# EAGLE design base (EAGLE 6.1)
APVD: B.F (15-01-03); DOC_ID: CLK-SCH-07; DOC_PART_NO: CLK-PC-07; DOC_REV: C; DOC_TITLE: Display (model B) - Base; PROJECT_NAME: Alarm Clock (Model B)

## Sheet 1 of 2
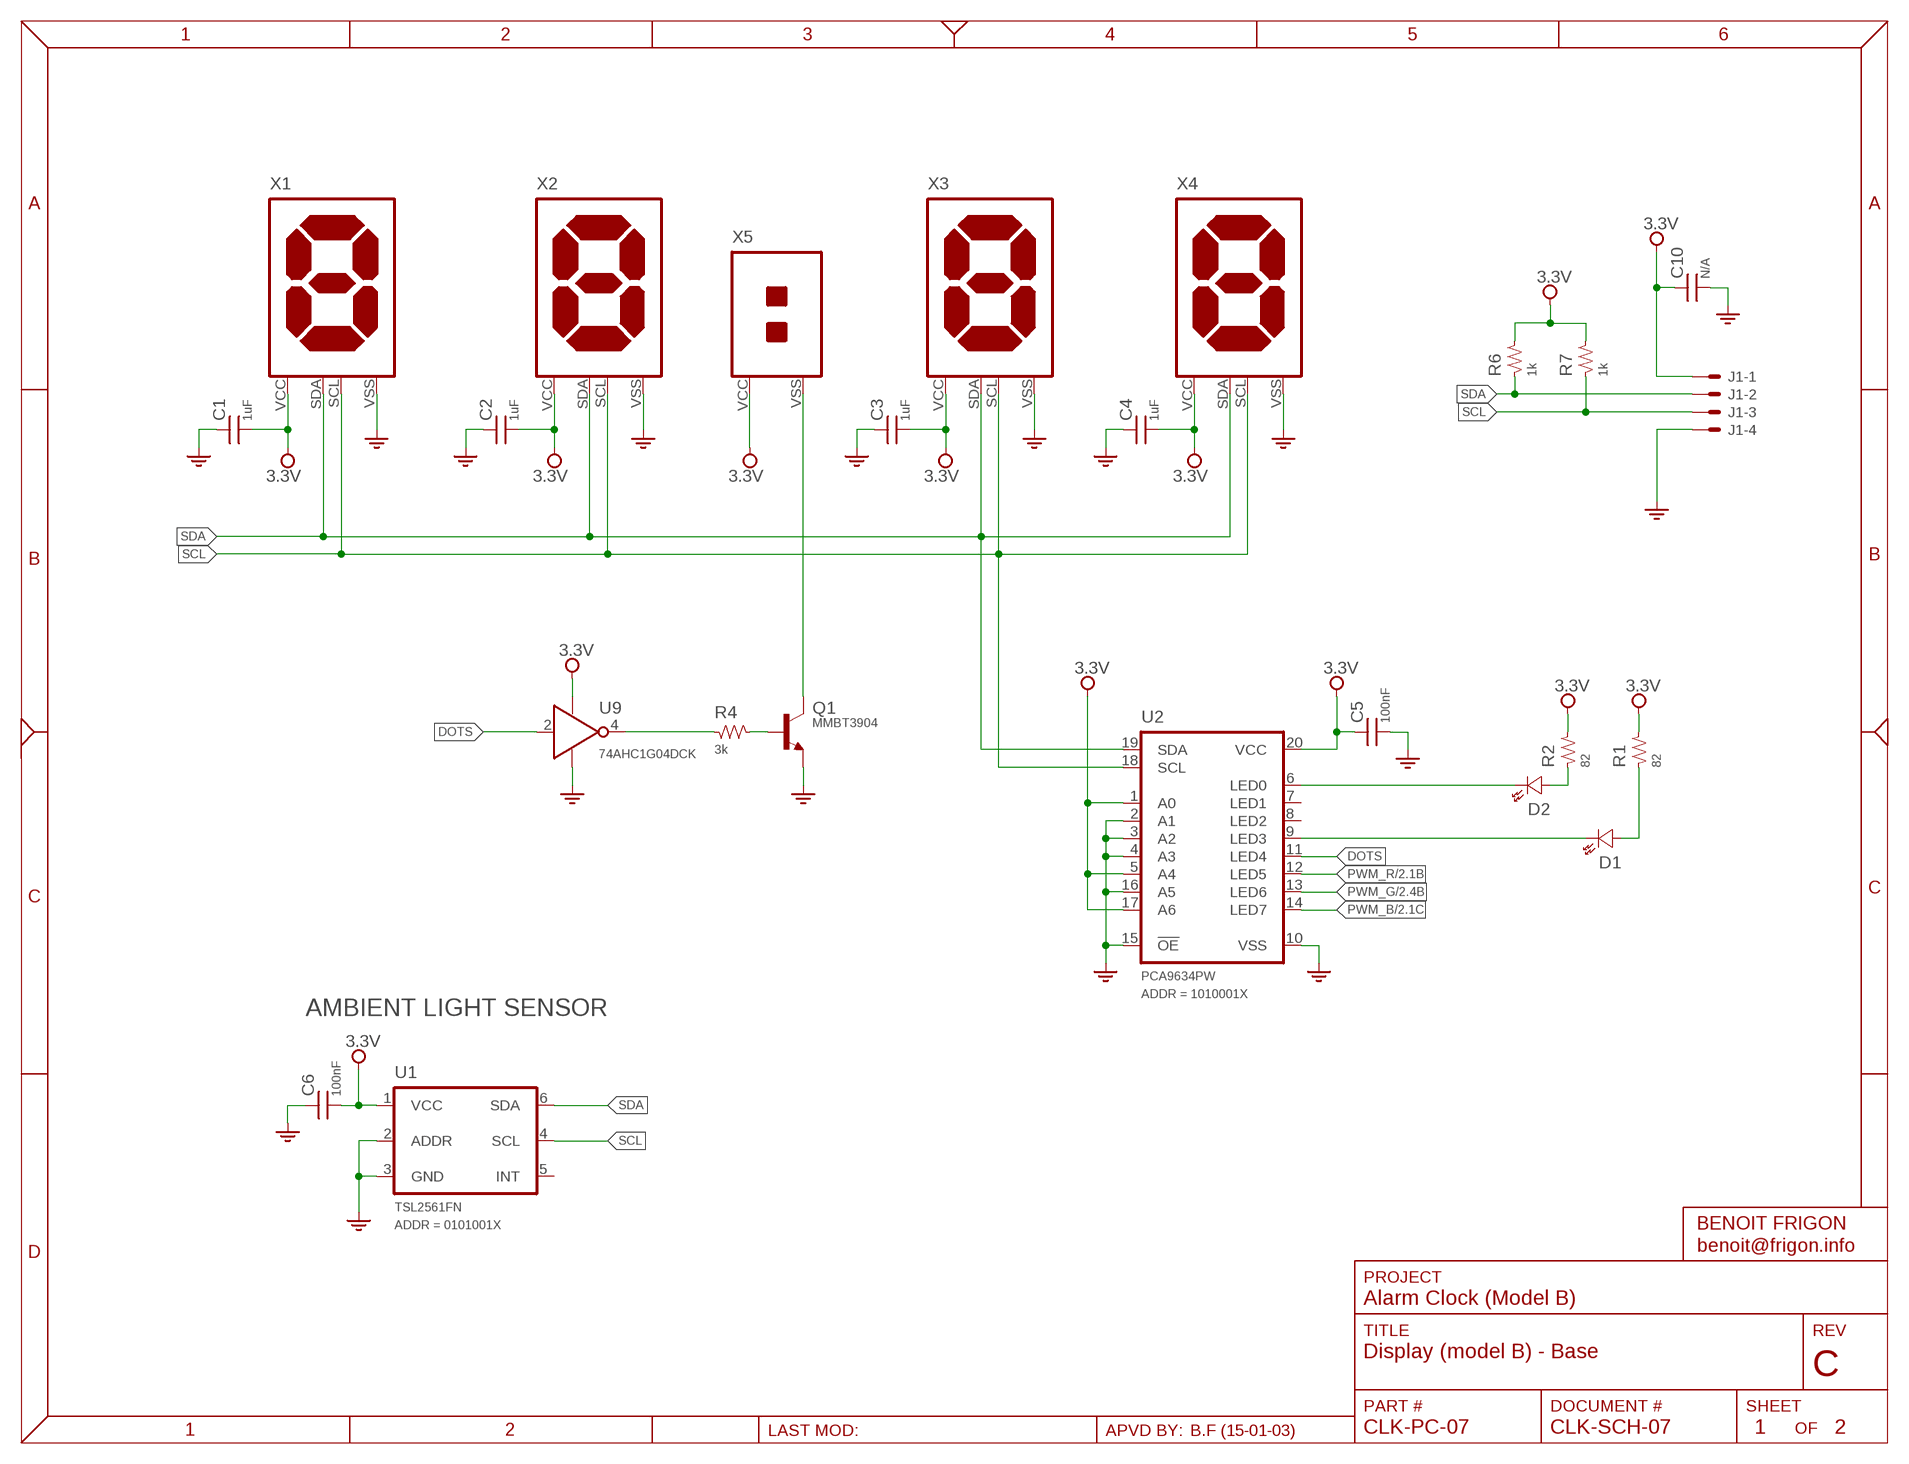
[diagram p0: schematic, sheet 1]

### Parts
C1  1uF  CAP-0603  [SMD_0603]
C2  1uF  CAP-0603  [SMD_0603]
C3  1uF  CAP-0603  [SMD_0603]
C4  1uF  CAP-0603  [SMD_0603]
C5  100nF  CAP-0603  [SMD_0603]
C6  100nF  CAP-0603  [SMD_0603]
C10  N/A  CAP-0805  [SMD_0805]
D1  {ATTR:COLOR}  LED-T1  [LED_3MM]
D2  {ATTR:COLOR}  LED-T1  [LED_3MM]
J1  SNG-2MM-HEADER-07-V  [DF3X-7P-2DSA]
Q1  MMBT3904  [SOT23]
R1  82  RES-0603  [SMD_0603]
R2  82  RES-0603  [SMD_0603]
R4  3k  RES-0603  [SMD_0603]
R6  1k  RES-0603  [SMD_0603]
R7  1k  RES-0603  [SMD_0603]
U1  TSL2561FN  [DFN-6]
U2  PCA9634PW  [TSSOP20]
U9  74AHC1G04DCK  [SC70-5]
X1  CLOCK_LED_SEGMENT  [CLOCK_LED_SEGMENT]
X2  CLOCK_LED_SEGMENT  [CLOCK_LED_SEGMENT]
X3  CLOCK_LED_SEGMENT  [CLOCK_LED_SEGMENT]
X4  CLOCK_LED_SEGMENT  [CLOCK_LED_SEGMENT]
X5  CLOCK_LED_DOTS  [CLOCK_LED_DOTS]

### Nets
3.3V: C1.2 C2.2 C3.2 C4.2 C5.1 C6.2 C10.1 J1.1 R1.2 R2.2 R6.2 R7.2 U1.1(VCC) U2.1(A0) U2.5(A4) U2.17(A6) U2.20(VCC) U9.5(VCC) X1.VCC X2.VCC X3.VCC X4.VCC X5.VCC ; also sheet 2
DOTS: U2.11(LED4) U9.2(A)
GND: C1.1 C2.1 C3.1 C4.1 C5.2 C6.1 C10.2 J1.4 Q1.2(E) U1.2(ADDR) U1.3(GND) U2.2(A1) U2.3(A2) U2.4(A3) U2.10(VSS) U2.15(!OE) U2.16(A5) U9.3(GND) X1.VSS X2.VSS X3.VSS X4.VSS ; also sheet 2
N$15: Q1.3(C) X5.VSS
N$16: Q1.1(B) R4.2
N$18: D2.K U2.6(LED0)
N$19: D2.A R2.1
N$20: D1.A R1.1
N$21: D1.K U2.9(LED3)
N$26: R4.1 U9.4(Y)
PWM_B: U2.14(LED7) ; also sheet 2
PWM_G: U2.13(LED6) ; also sheet 2
PWM_R: U2.12(LED5) ; also sheet 2
SCL: J1.3 R7.1 U1.4(SCL) U2.18(SCL) X1.SCL X2.SCL X3.SCL X4.SCL
SDA: J1.2 R6.1 U1.6(SDA) U2.19(SDA) X1.SDA X2.SDA X3.SDA X4.SDA
Unconnected: J1.5 J1.6 J1.7 U1.5(INT) U2.7(LED1) U2.8(LED2)

### Notes on the sheet
- AMBIENT LIGHT SENSOR

## Sheet 2 of 2: RGB Lighting
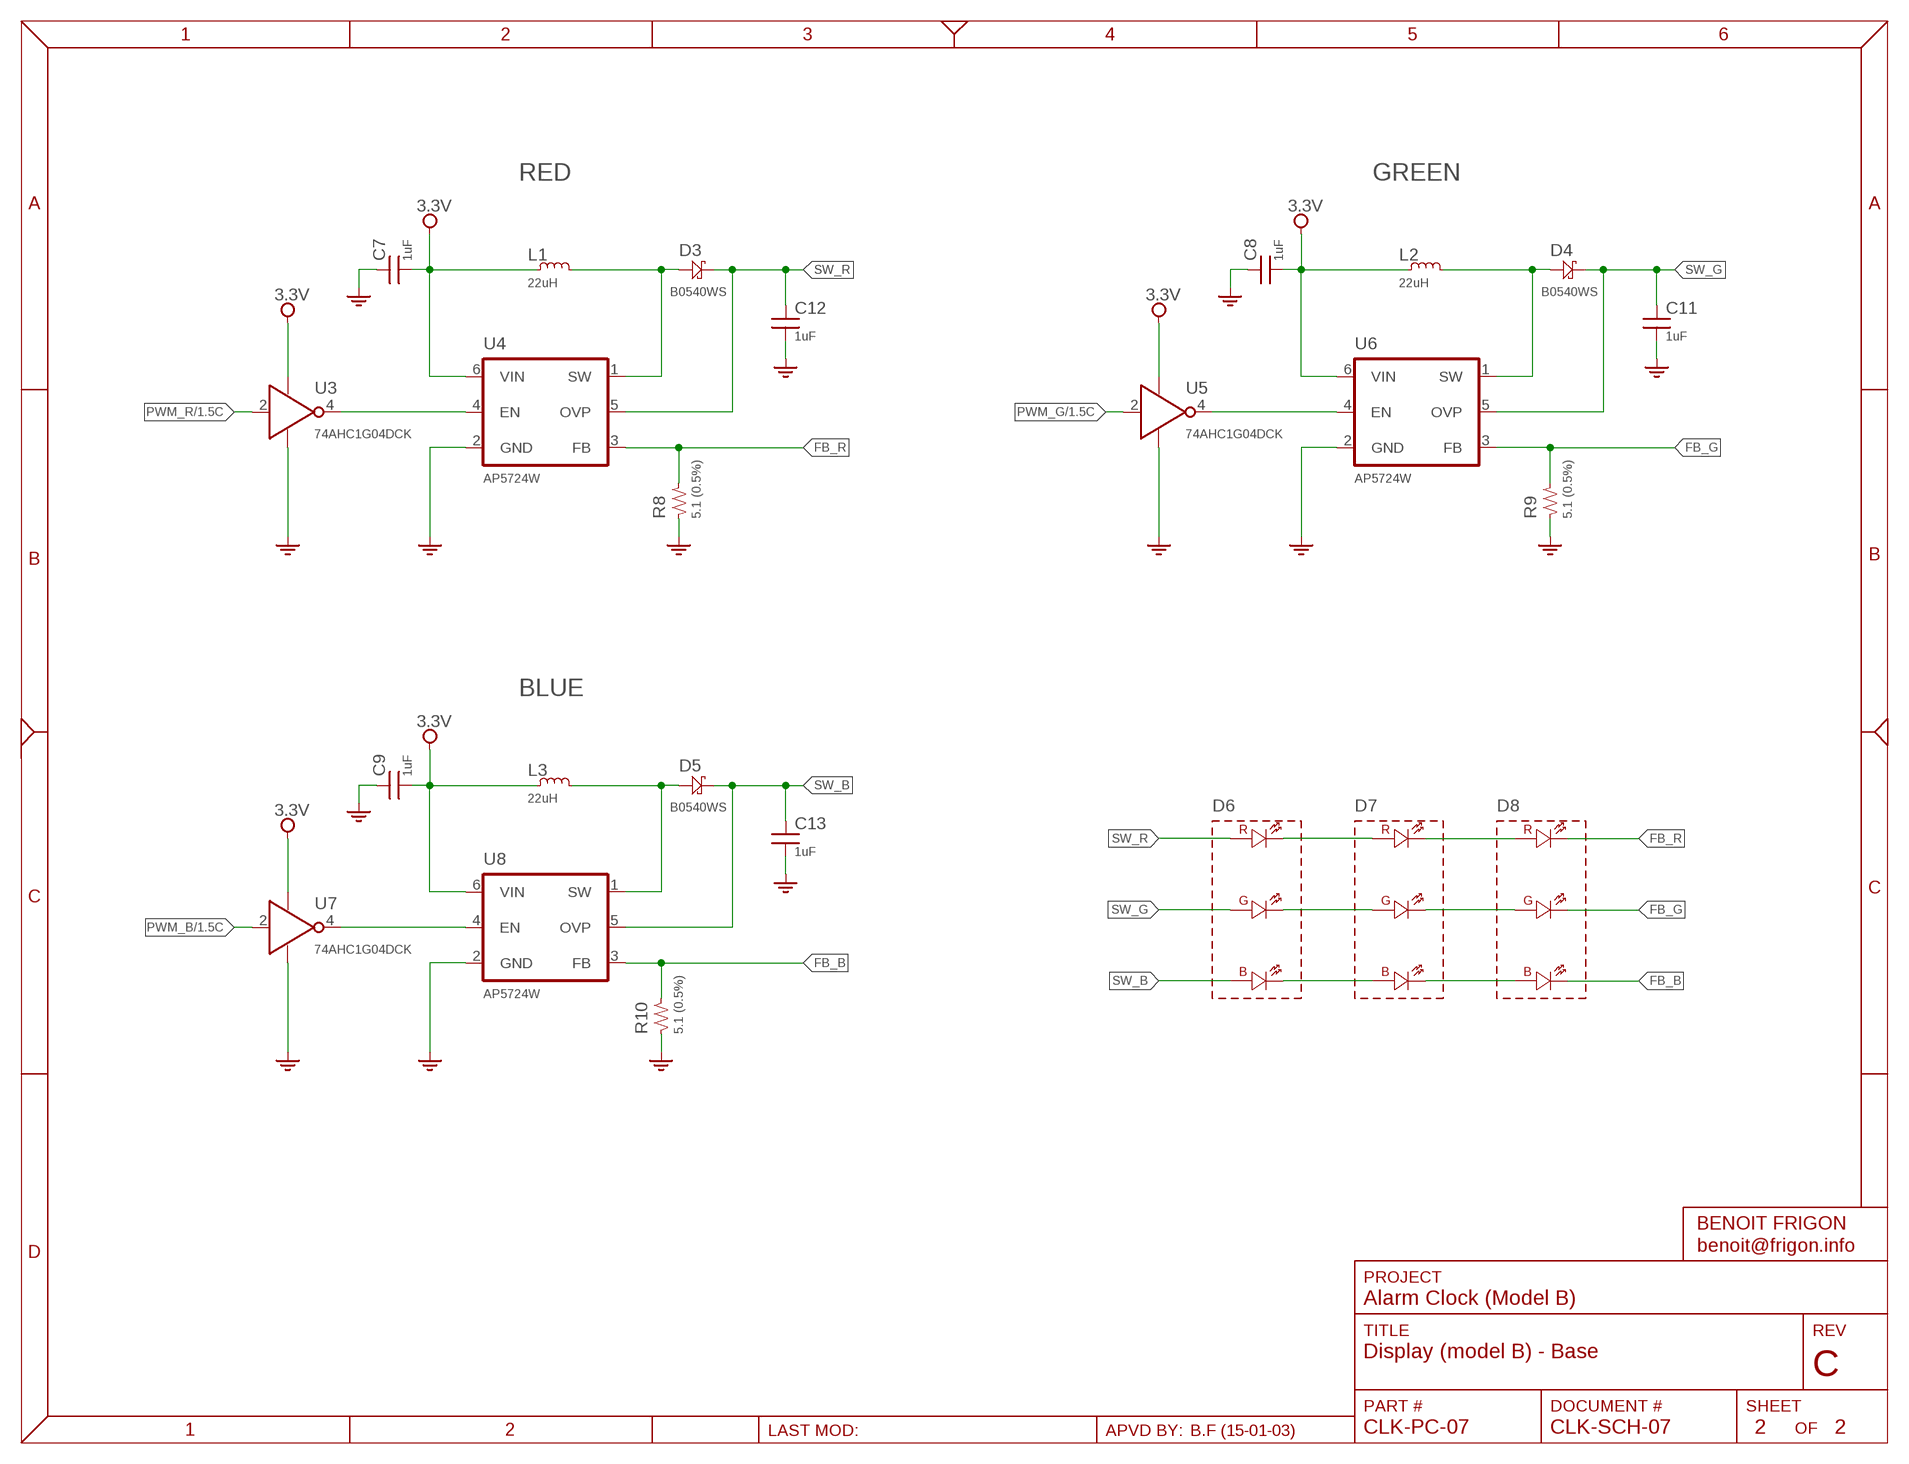
[diagram p1: schematic, sheet 2]
FRAME2 (FRAME_LETTER): DOC_SUBTITLE: RGB lighting

### Parts
C7  1uF  CAP-0603  [SMD_0603]
C8  1uF  CAP-0603  [SMD_0603]
C9  1uF  CAP-0603  [SMD_0603]
C11  1uF  CAP-0603  [SMD_0603]
C12  1uF  CAP-0603  [SMD_0603]
C13  1uF  CAP-0603  [SMD_0603]
D3  DIODE_SCHOTTKY-SOD323  [SOD-323]
D4  DIODE_SCHOTTKY-SOD323  [SOD-323]
D5  DIODE_SCHOTTKY-SOD323  [SOD-323]
D6  SMP6-RGB  [LED_RGB_PLCC6]
D7  SMP6-RGB  [LED_RGB_PLCC6]
D8  SMP6-RGB  [LED_RGB_PLCC6]
L1  22uH  IND-4X4  [IND-4X4]
L2  22uH  IND-4X4  [IND-4X4]
L3  22uH  IND-4X4  [IND-4X4]
R8  5.1 (0.5%)  RES-0603  [SMD_0603]
R9  5.1 (0.5%)  RES-0603  [SMD_0603]
R10  5.1 (0.5%)  RES-0603  [SMD_0603]
U3  74AHC1G04DCK  [SC70-5]
U4  AP5724W  [SOT23-6]
U5  74AHC1G04DCK  [SC70-5]
U6  AP5724W  [SOT23-6]
U7  74AHC1G04DCK  [SC70-5]
U8  AP5724W  [SOT23-6]

### Nets
3.3V: C7.2 C8.2 C9.2 L1.1 L2.1 L3.1 U3.5(VCC) U4.6(VIN) U5.5(VCC) U6.6(VIN) U7.5(VCC) U8.6(VIN) ; also sheet 1
FB_B: D8.5(BK) R10.2 U8.3(FB)
FB_G: D8.1(GK) R9.2 U6.3(FB)
FB_R: D8.3(RK) R8.2 U4.3(FB)
GND: C7.1 C8.1 C9.1 C11.2 C12.2 C13.2 R8.1 R9.1 R10.1 U3.3(GND) U4.2(GND) U5.3(GND) U6.2(GND) U7.3(GND) U8.2(GND) ; also sheet 1
N$1: D6.3(RK) D7.4(RA)
N$2: D7.3(RK) D8.4(RA)
N$3: D7.1(GK) D8.2(GA)
N$4: D6.1(GK) D7.2(GA)
N$5: D6.5(BK) D7.6(BA)
N$6: D7.5(BK) D8.6(BA)
N$8: D3.A L1.2 U4.1(SW)
N$10: D4.A L2.2 U6.1(SW)
N$12: D5.A L3.2 U8.1(SW)
N$25: U3.4(Y) U4.4(EN)
N$28: U5.4(Y) U6.4(EN)
N$29: U7.4(Y) U8.4(EN)
PWM_B: U7.2(A) ; also sheet 1
PWM_G: U5.2(A) ; also sheet 1
PWM_R: U3.2(A) ; also sheet 1
SW_B: C13.1 D5.K D6.6(BA) U8.5(OVP)
SW_G: C11.1 D4.K D6.2(GA) U6.5(OVP)
SW_R: C12.1 D3.K D6.4(RA) U4.5(OVP)

### Notes on the sheet
- RED | GREEN
- BLUE

## Library data of the parts
C1-C9 C11-C13 = Passive:CAP: Capacitor; DESCRIPTION: {DESCRIPTION} - SMT 0603 - {value}; PACKAGE: SMT 0603
C10 = Passive:CAP: Capacitor; DESCRIPTION: {DESCRIPTION} - SMT 0805 - {value}; PACKAGE: SMT 0805
D1 D2 = Optoelectronic:LED: Led; COLOR: Green; DESCRIPTION: {DESCRIPTION} T1 (3mm) - {ATTR:COLOR}; PACKAGE: T1; SKU: -
D3-D5 = Passive:DIODE_SCHOTTKY: Schottky Diode; DESCRIPTION: {DESCRIPTION} - SMT 0603 - {VALUE}; PACKAGE: SOD-323; PART_NO: B0540WS; SKU: {VALUE}
D6-D8 = Optoelectronic:SMP6-RGB: SMT RGB Led - PLCC6; MFG: Bivar; SKU: SMP6-RGB
J1 = Connectors:SNG-2MM-HEADER-07: 2mm Single Row Header - 7 pos; DESCRIPTION: {DESCRIPTION} - SMT Vertical; MFG: Hirose Electronic; PART_NO: DF3A-7P-2DSA; PRICE: 0.37; SKU: H2099-ND; SUPPLIER: Digi-Key
L1-L3 = Passive:IND?*: Inductor; PART_NO: NR4012T220M
Q1 = Transistor:MMBT3904: NPN Transistor
R1 R2 R4 R6-R10 = Passive:RES: Resistor; DESCRIPTION: {DESCRIPTION} - SMT 0603 - {VALUE}; PACKAGE: SMT 0603
U1 = Optoelectronic:TSL2561: Light-to-digital converter; ADDR: 0101001X
U2 = IC:PCA9634: 8-bit fm+ i2c-bus LED driver The PCA9634 is an I2C-bus controlled 8-bit LED driver optimized for Red/Green/Blue/Amber (RGBA) color mixing applications. Each LED output has its own 8-bit resolution (256 steps) fixed frequency Individual PWM controller that operates at 97 kHz with a duty cycle that is adjustable from 0 % to 99.6 % to allow the LED to be set to a specific brightness value. An additional 8-bit resolution (256 steps) Group PWM controller has both a fixed frequency of 190 Hz and an adjustable frequency between 24 Hz to once every 10.73 seconds with a duty cycle that is adjustable from 0 % to 99.6 % that is used to either dim or blink all LEDs with the same value. Features 8 LED drivers. Each output programmable at: Off On Programmable LED brightness Programmable group dimming/blinking mixed with individual LED brightness 1 MHz Fast-mode Plus compatible I2C-bus interface with 30 mA high drive capability on SDA output for driving high capacitive buses 256-step (8-bit) linear programmable brightness per LED output varying from fully off (default) to maximum brightness using a 97 kHz PWM signal 256-step group brightness control allows general dimming (using a 190 Hz PWM signal) from fully off to maximum brightness (default) 256-step group blinking with frequency programmable from 24 Hz to 10.73 s and duty cycle from 0 % to 99.6 % Eight totem-pole outputs (sink 25 mA and source 10 mA at 5 V) with software programmable open-drain LED outputs selection (default at totem-pole). No input function. Output state change programmable on the Acknowledge or the STOP Command to update outputs byte-by-byte or all at the same time (default to ‘Change on STOP’). Active LOW Output Enable (OE) input pin. LED outputs programmable to 1, 0 or ‘high-impedance’ (default at power-up) when OE is HIGH, thus allowing hardware blinking and dimming of the LEDs. 7 hardware address pins allow 126 devices to be connected to the same I2C-bus 4 software programmable I2C-bus addresses (one LED Group Call address and three LED Sub Call addresses) allow groups of devices to be addressed at the same time in any combination (for example, one register used for ‘All Call’ so that all the PCA9634s on the I2C-bus can be addressed at the same time and the second register used for three different addresses so that 1⁄3 of all devices on the bus can be addressed at the same time in a group). Software enable and disable for I2C-bus address. Software Reset feature (SWRST Call) allows the device to be reset through the I2C-bus 25 MHz internal oscillator requires no external components Internal power-on reset Noise filter on SDA/SCL inputs Edge rate control on outputs No glitch on power-up Supports hot insertion Low standby current Operating power supply voltage range of 2.3 V to 5.5 V 5.5 V tolerant inputs; ADDR: 1010001X; MFG: NXP Semiconductors
U3 U5 U7 U9 = Logic:74*1G04: NOT Gate - Single
U4 U6 U8 = IC:AP5724: White LED Step-up converter; MFG: Diodes Inc.
X1-X4 = Misc:CLOCK_LED_SEGMENT; BOM: FALSE
X5 = Misc:CLOCK_LED_DOTS; BOM: FALSE

## Board
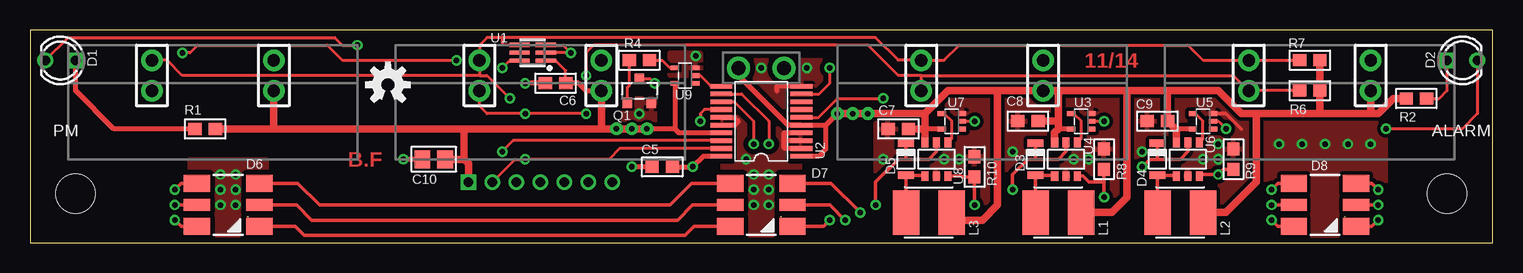
[diagram p2: board, top side]
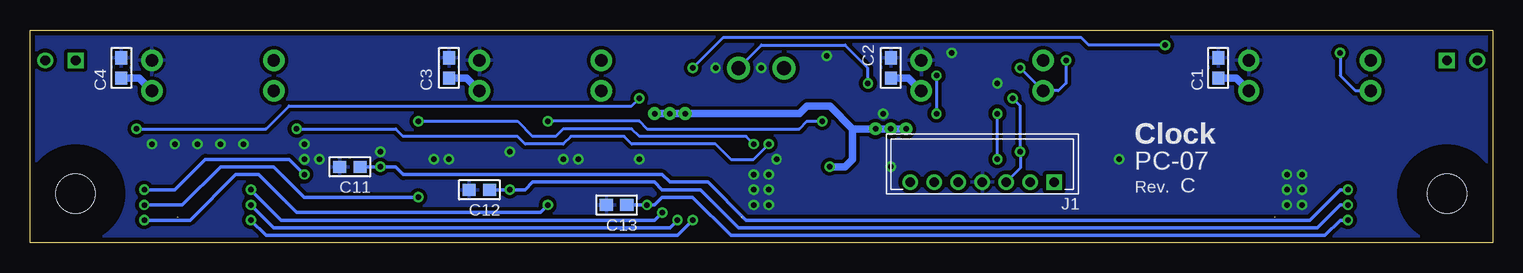
[diagram p3: board, bottom side, seen from below]

Size 121.92 x 17.78 mm. Coordinates in mm from the lower left corner, seen from the top.
Outline: 0,0 121.92,0 121.92,17.78 0,17.78 0,0
Copper layers (1*16): Top 0.035mm / dielectric 1.5mm / Bottom 0.035mm
Design rules: minimum track width 10mil, minimum drill 16mil, track to track 8mil, track to pad 8mil, pad to pad 8mil, via to via 8mil, smd to smd 8mil, copper to edge 16mil, drill to drill 8mil, minimum pad ring 10mil, minimum via ring 8mil, stop-mask expansion 4mil, vias tented up to drill 20mil, thermal gap 10mil
Holes 3.28 mm at 3.81,4.11 118.11,4.11
tRestrict: area 0,0.3 to 7.6,7.9; area 114.3,0.3 to 121.9,7.9; area 95.9,4.4 to 97.2,5.1; area 85.7,4.4 to 87,5.1; area 74.9,4.4 to 76.2,5.1
bRestrict: area 0,0.3 to 7.6,7.9; area 114.3,0.3 to 121.9,7.9

### Footprints (pad centres in the part's own frame; a part is rotated, then mirrored left to right if it is on the bottom)
SMD_0603 = smd 1.1 x 1: 1 -0.85,0; 2 0.85,0
SMD_0805 = smd 1.3 x 1.5: 1 -0.95,0; 2 0.95,0
LED_3MM = drill 0.8 square: A -1.27,0 | drill 0.8: K 1.27,0
SOD-323 = smd 0.65 x 1.35: A -1.33,0; K 1.33,0
LED_RGB_PLCC6 = smd 2.2 x 1.4: 1 2.6,1.8; 2 -2.6,1.8; 5 2.6,-1.8; 6 -2.6,-1.8 | smd 2.2 x 1: 3 2.6,0; 4 -2.6,0
DF3X-7P-2DSA = drill 0.8 square: 1 6,0 | drill 0.8: 2 4,0; 3 2,0; 4 0,0; 5 -2,0; 6 -4,0; 7 -6,0
IND-4X4 = smd 2.2 x 3.7: 1 -1.9,0; 2 1.9,0
SOT23 = smd 0.8 x 0.9: 1 -1,-1; 2 1,-1; 3 0,1
DFN-6 = smd 1.7 x 0.35: 1 -1.1,0.65; 2 -1.1,0; 3 -1.1,-0.65; 4 1.1,-0.65; 5 1.1,0; 6 1.1,0.65
TSSOP20 = smd 0.38 x 1.8: 1 -2.925,-3.35; 2 -2.275,-3.35; 3 -1.625,-3.35; 4 -0.975,-3.35; 5 -0.325,-3.35; 6 0.325,-3.35; 7 0.975,-3.35; 8 1.625,-3.35; 9 2.275,-3.35; 10 2.925,-3.35; 11 2.925,3.35; 12 2.275,3.35; 13 1.625,3.35; 14 0.975,3.35; 15 0.325,3.35; 16 -0.325,3.35; 17 -0.975,3.35; 18 -1.625,3.35; 19 -2.275,3.35; 20 -2.925,3.35
SC70-5 = smd 0.4 x 0.7: 1 -0.65,-0.85; 2 0,-0.85; 3 0.65,-0.85; 4 0.65,0.85; 5 -0.65,0.85
SOT23-6 = smd 0.6 x 0.8: 1 -0.95,-1.4; 2 0,-1.4; 3 0.95,-1.4; 4 0.95,1.4; 5 0,1.4; 6 -0.95,1.4
CLOCK_LED_SEGMENT = drill 1.016 pad 1.778: SCL -5.08,1.27; SDA -5.08,-1.27; VCC 5.08,-1.27; VSS 5.08,1.27
CLOCK_LED_DOTS = drill 1.168 pad 1.93: VCC -1.905,0; VSS 1.905,0

### Placement (x,y rotation side)
C1  22.86,14.61 270 bottom
C2  50.16,14.61 270 bottom
C3  87,14.61 270 bottom
C4  114.3,14.61 270 bottom
C5  52.7,6.35 180 top
C6  43.81,13.34 0 top
C7  72.39,9.53 0 top
C8  83.19,10.16 0 top
C9  93.98,10.16 0 top
C10  33.66,6.99 180 top
C11  95.25,6.35 180 bottom
C12  84.45,4.45 180 bottom
C13  73.03,3.17 180 bottom
D1  2.54,15.24 180 top
D2  119.38,15.24 0 top
D3  83.82,6.99 90 top
D4  93.98,6.99 90 top
D5  73.03,6.99 90 top
D6  16.51,3.17 0 top
D7  60.96,3.17 0 top
D8  107.95,3.17 0 top
J1  42.55,5.08 0 bottom
L1  85.72,2.54 180 top
L2  95.89,2.54 180 top
L3  74.93,2.54 180 top
Q1  50.8,12.7 0 top
R1  14.61,9.53 0 top
R2  115.57,12.06 180 top
R4  50.8,15.24 180 top
R6  106.68,12.7 0 top
R7  106.68,15.24 0 top
R8  89.53,6.99 270 top
R9  100.33,6.99 270 top
R10  78.74,6.35 270 top
U1  41.91,15.88 180 top
U2  60.96,10.16 90 top
U3  87.63,10.16 90 top
U4  86.36,6.99 0 top
U5  97.79,10.16 90 top
U6  96.52,6.99 0 top
U7  76.83,10.16 90 top
U8  75.56,6.99 0 top
U9  54.61,13.97 90 top
U$1  [INFO_DATE]  87.88,14.61 0 top
U$3  [OPENHW_LOGO_150]  29.84,13.21 0 top
U$4  [INFO_COMPACT]  24.77,6.73 0 bottom
U$5  [INFO_AUTHOR]  27.94,6.99 0 top
X1  15.24,13.97 0 top
X2  42.55,13.97 0 top
X3  79.38,13.97 0 top
X4  106.68,13.97 0 top
X5  60.96,14.61 0 top

### Tracks (layer width: path | path; a pad name or v marks a point on that pad's centre or on a via)
3.3V  (via drill 0.46, 0.46 pad 1.07)
  Top 0.254: C6.2 44.66,14.39 43.83,15.22 U1.1
  Top 0.406: C5.1 v55.24,6.35 56.13,7.24 U2.20 | C6.2 45.72,13.34 46.35,12.7 X2.VCC | 66.35,9.84 U2.5 63.19,9.84 59.05,13.97 X5.VCC | 66.35,9.84 v67.31,10.79 | U7.5 74.61,9.51 | U3.5 85.72,9.51 85.72,10.16 | U2.17 54.1,9.19 53.76,9.53 | U9.5 53.76,9.53 | 53.76,9.53 v51.44,9.53 | 66.35,9.84 66.35,7.87 65.72,7.24 U2.1 | U5.5 95.57,9.51 95.57,9.42
  Top 0.61: R1.2 20.32,9.53 | X1.VCC 20.32,9.53 | 20.32,9.53 36.2,9.53 | 36.2,9.53 47.62,9.53 | 47.62,9.53 v48.9,9.53 v50.16,9.53 v51.44,9.53 | 80.64,12.7 76.52,12.7 74.61,10.79 | 80.64,12.7 X3.VCC 85.72,12.7 | 85.72,12.7 91.44,12.7 | 91.44,12.7 94.83,12.7 | 94.83,12.7 99.06,12.7 100.97,10.79 102.23,10.79 | 36.2,9.53 36.2,6.99 | J1.1 36.55,6.63 36.2,6.99 | 36.2,6.99 C10.1 | 102.23,10.79 107.53,10.79 | 107.53,10.79 111.76,10.79 | 111.76,10.79 112.39,10.79 113.67,12.06 R2.2 | X2.VCC 47.62,9.53 | X4.VCC 111.76,10.79 | R7.2 R6.2 107.53,10.79 | v67.31,10.79 v68.58,10.79 v69.85,10.79 74.61,10.79 | 74.61,10.79 74.61,9.51 | 74.61,9.51 U8.6 | 80.64,12.7 80.64,3.17 79.38,1.91 76.83,1.91 L3.1 | C8.2 85.72,10.16 | 85.72,10.16 85.72,12.7 | U4.6 85.41,9.21 85.72,9.53 85.72,10.16 | L1.1 90.17,2.54 91.44,3.81 91.44,12.7 | L2.1 99.69,2.54 102.23,5.08 102.23,10.79 | 94.83,12.7 C9.2 95.57,9.42 U6.6 | C7.2 73.24,9.51 74.61,9.51
  Bottom 0.61: 53.34,9.53 53.34,6.99 53.98,6.35 v55.24,6.35 | 53.34,9.53 v51.44,9.53 v50.16,9.53 v48.9,9.53 | 53.34,9.53 55.24,11.43 57.15,11.43 57.78,10.79 v68.58,10.79 v69.85,10.79 | C4.2 112.81,13.76 X4.VCC | C3.2 85.51,13.76 X3.VCC | C2.2 48.68,13.76 X2.VCC | C1.2 21.38,13.76 X1.VCC
DOTS
  Top 0.254: U2.11 56.77,13.09 55.88,13.97 U9.2
FB_B  (via drill 0.46)
  Top 0.305: D8.5 111.86,1.38 v112.39,1.91 | v78.74,3.17 R10.2 77.69,5.5 77.6,5.58 U8.3
  Bottom 0.305: v112.39,1.91 108.58,1.91 104.78,5.71 102.87,5.71 99.69,2.54 79.38,2.54 v78.74,3.17
FB_G  (via drill 0.46)
  Top 0.305: D8.1 111.86,4.97 v112.39,4.45 | 100.33,6.35 R9.2 99.48,6.13 v99.06,5.71 97.47,5.71 U6.3
  Bottom 0.305: v112.39,4.45 109.86,4.45 107.31,6.99 100.33,6.99 v99.06,5.71
FB_R  (via drill 0.46)
  Top 0.305: D8.3 v112.39,3.17 | 89.53,5.08 v89.53,3.81 | R8.2 89.53,5.08 | 89.53,5.08 88.27,5.08 87.76,5.58 U4.3
  Bottom 0.305: v112.39,3.17 109.22,3.17 106.05,6.35 101.6,6.35 99.06,3.81 v89.53,3.81
GND  (via drill 0.46)
  Top 0.254: U1.3 43.02,16.51 44.45,16.51 v45.09,15.88 U1.2
  Top 0.305: U5.3 99.68,10.81 100.97,9.53
  Top 0.406: U2.16 58.73,9.84 59.05,10.16 58.73,10.48 U2.15 | C5.2 v50.16,6.35 | C6.1 v41.27,13.34 | C10.2 v31.11,6.99 | U2.10 62.23,13.09 62.23,12.7 | U2.4 62.87,9.19 62.87,8.54 | U2.3 62.87,8.54 | U2.2 62.87,7.88 62.87,8.54
  other vias: 17.14,3.17 17.14,5.71 15.88,5.71 17.14,4.45 15.88,3.17 59.69,6.99 60.33,5.71 60.33,4.45 15.88,4.45 64.77,14.61 60.96,14.61 50.8,10.79 55.5,15.62 99.06,8.26 77.47,6.99 71.12,6.99 60.33,3.17 76.2,6.99 81.92,7.62 87,6.99 88.27,6.99 97.79,6.99 99.06,6.99 92.71,7.62 104.14,8.26 106.05,8.26 107.95,8.26 109.86,8.26 111.76,8.26 61.59,5.71 61.59,4.45 61.59,3.17
  pour Bottom (isolate 0.305): 0,17.78 121.92,17.78 121.92,0 0,0
  pour Top (isolate 0.305): 70.48,0 113.03,0 113.03,12.06 70.48,12.06
  pour Top (isolate 0.406): 64.14,0.64 57.78,0.64 57.78,15.24 66.04,15.24 66.04,12.7 64.14,12.7
  pour Top (isolate 0.406): 19.68,0.64 13.34,0.64 13.34,6.99 19.68,6.99
  pour Top: 49.53,10.16 49.53,12.06 52.07,12.06 52.07,10.16
  pour Top: 53.34,13.97 53.34,15.88 55.88,15.88 55.88,13.97
N$1
  Top 0.305: D7.4 55.24,3.17 53.98,1.91 23.5,1.91 22.23,3.17 D6.3
N$2  (via drill 0.46)
  Top 0.305: D8.4 v103.5,3.17 | D7.3 66.67,3.17 v67.94,1.91
  Bottom 0.305: v67.94,1.91 68.58,1.27 101.6,1.27 v103.5,3.17
N$3  (via drill 0.46)
  Top 0.305: D7.1 66.78,4.97 v69.22,2.54 | D8.2 104.03,4.97 v103.5,4.45
  Bottom 0.305: v69.22,2.54 69.85,1.91 100.97,1.91 v103.5,4.45
N$4
  Top 0.305: D6.1 22.33,4.97 24.13,3.17 53.34,3.17 55.14,4.97 D7.2
N$5
  Top 0.305: D6.5 22.12,1.38 22.86,0.64 54.61,0.64 55.35,1.38 D7.6
N$6  (via drill 0.46)
  Top 0.305: D8.6 104.03,1.38 v103.5,1.91 | D7.5 66.14,1.38 v66.67,1.91
  Bottom 0.305: v66.67,1.91 67.94,0.64 102.23,0.64 v103.5,1.91
N$8
  Top 0.305: L1.2 D3.A 85.41,5.66 U4.1
N$10
  Top 0.305: U6.1 95.57,5.66 D4.A L2.2
N$12
  Top 0.305: U8.1 74.61,5.66 D5.A L3.2
N$15  (via drill 0.46)
  Top 0.254: Q1.3 51.7,13.7 v52.07,13.34
  Bottom 0.254: X5.VSS 60.96,16.51 53.98,16.51 52.07,14.61 v52.07,13.34
N$16
  Top 0.254: Q1.1 49.8,12.97 49.95,13.12 R4.2
N$18  (via drill 0.46)
  Top 0.254: D2.K 120.65,10.79 119.38,9.53 v113.03,9.53 | U2.6 65.73,10.48 67.31,12.06 v71.12,12.06
  Bottom 0.254: v113.03,9.53 102.23,9.53 100.33,11.43 71.75,11.43 v71.12,12.06
N$19
  Top 0.254: R2.1 117.47,12.06 118.11,12.7 D2.A
N$20
  Top 0.406: R1.1 6.99,9.53 3.81,12.7 D1.A
N$21  (via drill 0.46)
  Top 0.254: D1.K 3.17,17.14 25.4,17.14 26.04,16.51 v27.3,16.51 | U2.9 65.78,12.44 66.67,13.34 v66.67,14.61
  Bottom 0.254: v27.3,16.51 33.66,16.51 34.29,17.14 64.14,17.14 v66.67,14.61
N$25
  Top 0.254: U3.4 86.98,10.81 87.63,10.16 87.63,8.71 U4.4
N$26
  Top 0.254: U9.4 53.33,14.62 52.7,15.24 R4.1
N$28
  Top 0.254: U5.4 97.14,10.81 97.79,10.16 97.79,8.71 U6.4
N$29
  Top 0.254: U7.4 76.19,10.81 76.83,10.16 76.83,8.71 U8.4
PWM_B  (via drill 0.46)
  Top 0.254: U2.14 56.22,11.13 55.88,10.79 v55.88,10.16 | U7.2 v78.74,10.16
  Bottom 0.254: v55.88,10.16 57.15,10.16 57.78,9.53 70.48,9.53 71.12,10.16 v78.74,10.16
PWM_G  (via drill 0.46)
  Top 0.254: U2.13 58.7,11.79 60.33,10.16 v60.33,8.26 | U5.2 99.06,10.16 v99.69,9.53
  Bottom 0.254: v60.33,8.26 61.59,6.99 63.5,6.99 64.77,8.26 71.75,8.26 72.39,8.89 76.83,8.89 77.47,8.26 80.64,8.26 81.28,8.89 90.81,8.89 91.44,9.53 v99.69,9.53
PWM_R  (via drill 0.46)
  Top 0.254: U2.12 59.32,12.44 61.59,10.16 v61.59,8.26 | U3.2 v89.53,10.16
  Bottom 0.254: v61.59,8.26 62.23,8.89 71.12,8.89 71.75,9.53 77.47,9.53 78.11,8.89 80.01,8.89 81.28,10.16 v89.53,10.16
SCL  (via drill 0.46)
  Top 0.254: v39.37,7.62 40.28,8.54 U2.18 | U1.4 39.38,16.52 39.38,17.13 39.37,17.14 | 37.47,13.97 38.1,13.97 v40.01,12.06 | 37.47,13.97 X2.SCL 37.47,16.51 38.1,17.14 39.37,17.14 | 37.47,13.97 12.7,13.97 11.43,15.24 X1.SCL | 39.37,17.14 70.48,17.14 72.39,15.24 X3.SCL 76.2,15.24 77.47,16.51 96.52,16.51 97.79,15.24 X4.SCL R7.1
  Bottom 0.254: J1.3 39.37,6.25 v39.37,7.62 39.37,11.43 v40.01,12.06
SDA  (via drill 0.46)
  Top 0.254: v35.56,15.24 26.04,15.24 24.77,16.51 13.97,16.51 13.34,15.88 v12.7,15.88 | U2.19 49.16,7.88 48.26,6.99 v41.27,6.99 40.45,6.99 J1.2 | X2.SDA 37.47,11.43 38.1,10.79 v41.27,10.79 v46.35,10.79 | U1.6 39.99,15.22 v39.37,14.61 | 74.3,13.97 72.39,13.97 69.85,16.51 46.99,16.51 46.35,15.88 v46.35,13.97 | X3.SDA 74.3,13.97 | 74.3,13.97 100.33,13.97 X4.SDA R6.1
  Bottom 0.254: v41.27,6.99 v41.27,10.79 | v12.7,15.88 12.7,13.97 11.43,12.7 X1.SDA | v39.37,14.61 X2.SDA 36.2,12.7 35.56,13.34 v35.56,15.24 | v46.35,13.97 v46.35,10.79
SW_B  (via drill 0.46)
  Top 0.305: D6.6 12.6,1.38 v12.06,1.91 | v70.48,3.17 70.48,5.08 72.39,6.99 73.03,6.99 | 73.03,6.99 74.93,6.99 75.56,7.62 U8.5 | D5.K 73.03,6.99
  Bottom 0.305: v12.06,1.91 12.7,1.91 13.97,0.64 63.5,0.64 66.67,3.81 69.22,3.81 69.85,3.17 v70.48,3.17 C13.1
SW_G  (via drill 0.46)
  Top 0.305: D6.2 12.6,4.97 v12.06,4.45 | U6.5 96.52,7.62 95.89,6.99 93.98,6.99 | D4.K 93.98,6.99 | 93.98,6.99 93.34,6.99 v92.71,6.35
  Bottom 0.305: v12.06,4.45 12.7,4.45 15.24,1.91 62.23,1.91 65.41,5.08 68.58,5.08 69.22,5.71 90.81,5.71 91.44,6.35 v92.71,6.35 C11.1
SW_R  (via drill 0.46)
  Top 0.305: D6.4 v12.06,3.17 | U4.5 86.36,7.62 85.72,6.99 83.82,6.99 | D3.K 83.82,6.99 | 83.82,6.99 83.19,6.99 81.92,5.71 v81.92,4.45
  Bottom 0.305: v12.06,3.17 12.7,3.17 14.61,1.27 62.87,1.27 66.04,4.45 69.22,4.45 69.85,5.08 80.01,5.08 80.64,4.45 v81.92,4.45 C12.1

### Text on the board
tPlace: PM | ALARM
_tsilk: U1 | D1 | R4 | R7 | D2 | U9 | C6 | U7 | U3 | U5 | R6 | R1 | Q1 | C7 | C8 | C9 | R2 | PM | ALARM | C5 | U2 | R10 | U4 | U6 | R9 | D6 | C10 | D5 | U8 | D3 | D8 | D7 | R8 | D4 | L3 | L1 | L2
_bsilk: C2 | C1 | C3 | C4 | Clock | PC-07 | C11 | C | Rev. | J1 | C12 | C13